# Altium schematic sheet Alim.SchDoc
size A; SheetNumber: 1; SheetTotal: 3
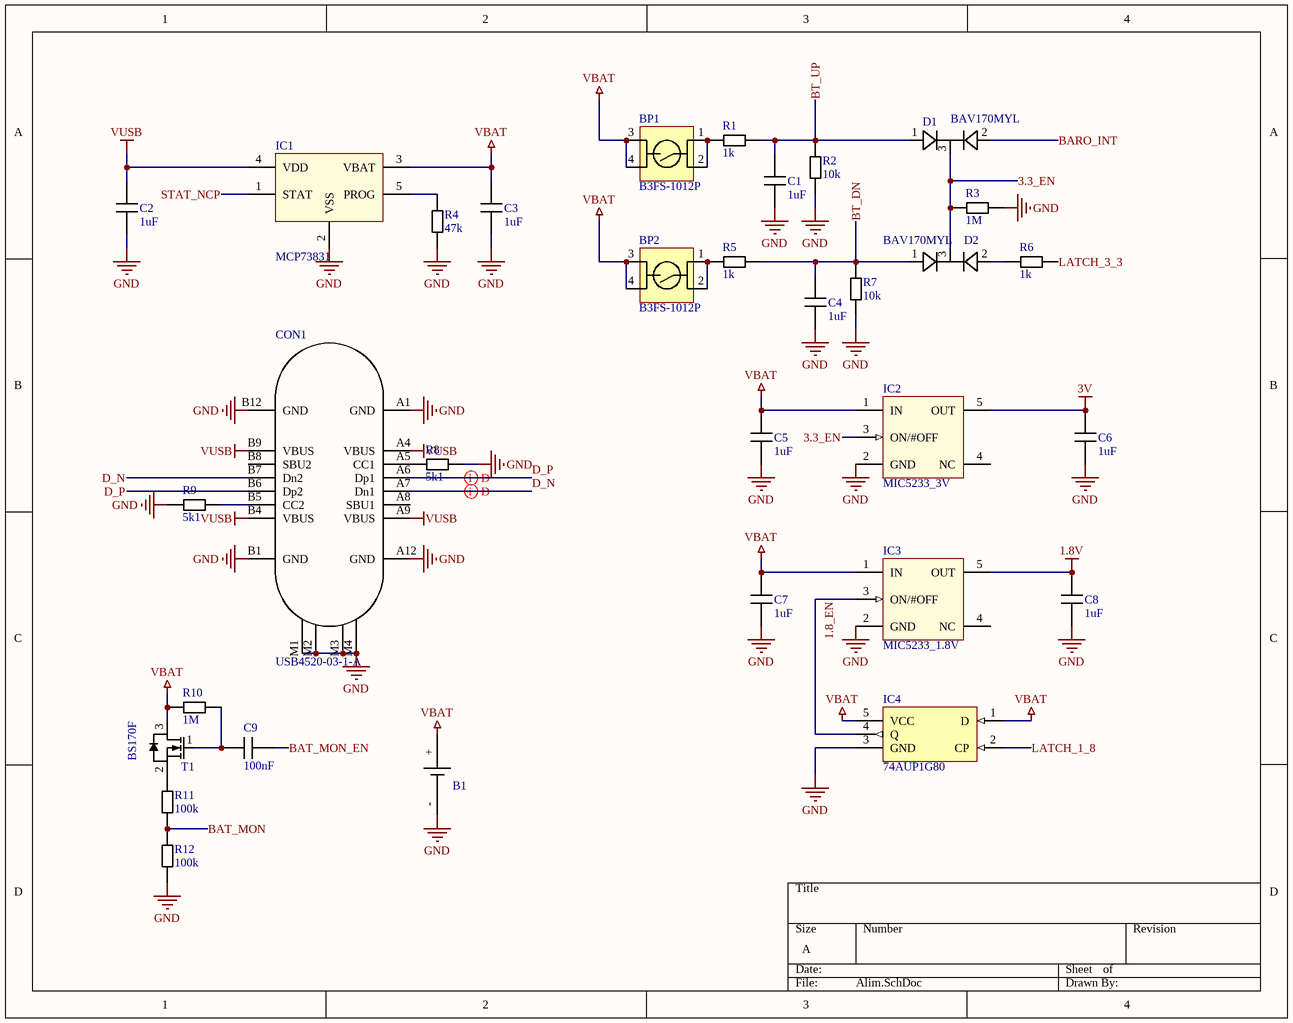
[diagram p0: Alim.SchDoc]

## Parts
B1  EC382704P-T  [EC382704P-T]  (value not drawn)
BP1  B3FS-1012P  [B3FS]
BP2  B3FS-1012P  [B3FS]
C1  value 1uF  [C0402]  (hidden comment: 1uF (0402) AEC-Q200)
C2  value 1uF  [C0402]  (hidden comment: 1uF (0402) AEC-Q200)
C3  value 1uF  [C0402]  (hidden comment: 1uF (0402) AEC-Q200)
C4  value 1uF  [C0402]  (hidden comment: 1uF (0402) AEC-Q200)
C5  value 1uF  [C0402]  (hidden comment: 1uF (0402) AEC-Q200)
C6  value 1uF  [C0402]  (hidden comment: 1uF (0402) AEC-Q200)
C7  value 1uF  [C0402]  (hidden comment: 1uF (0402) AEC-Q200)
C8  value 1uF  [C0402]  (hidden comment: 1uF (0402) AEC-Q200)
C9  value 100nF  [C0402]  (hidden comment: 100nF (0402) AEC-Q200)
CON1  USB4520-03-1-A  [USB4520-03-1-A]
D1  BAV170MYL  [DFN1006-3]
D2  BAV170MYL  [DFN1006-3]
IC1  MCP73831  [SOT23-5]
IC2  MIC5233_3V  [SOT23-5]
IC3  MIC5233_1.8V  [SOT23-5]
IC4  74AUP1G80  [TSSOP5]
R1  value 1k  [R0402]  (hidden comment: 1k (0402))
R2  value 10k  [R0402]  (hidden comment: 10k (0402))
R3  value 1M  [R0402]  (hidden comment: 1M (0402))
R4  value 47k  [R0402]  (hidden comment: 47k (0402))
R5  value 1k  [R0402]  (hidden comment: 1k (0402))
R6  value 1k  [R0402]  (hidden comment: 1k (0402))
R7  value 10k  [R0402]  (hidden comment: 10k (0402))
R8  value 5k1  [R0402]  (hidden comment: 5k1 (0402) AEC-Q200)
R9  value 5k1  [R0402]  (hidden comment: 5k1 (0402) AEC-Q200)
R10  value 1M  [R0402]  (hidden comment: 1M (0402))
R11  value 100k  [R0402]  (hidden comment: 100k (0402))
R12  value 100k  [R0402]  (hidden comment: 100k (0402))
T1  BS170F  [SOT-23-3]

## Nets
1.8V: C8.1 IC3.5(OUT)
3V: C6.1 IC2.5(OUT)
GND: B1.- C1.2 C2.2 C3.2 C4.2 C5.2 C6.2 C7.2 C8.2 CON1.A1(GND) CON1.A12(GND) CON1.B1(GND) CON1.B12(GND) CON1.M1 CON1.M2 CON1.M3 CON1.M4 IC1.2(VSS) IC2.2(GND) IC3.2(GND) IC4.3(GND) R2.1 R3.1 R4.1 R7.1 R8.2 R9.1 R12.1
VBAT: B1.+ BP1.3 BP1.4 BP2.3 BP2.4 C3.1 C5.1 C7.1 IC1.3(VBAT) IC2.1(IN) IC3.1(IN) IC4.1(D) IC4.5(VCC) R10.1 T1.3(D)
VUSB: C2.1 CON1.A4(VBUS) CON1.A9(VBUS) CON1.B4(VBUS) CON1.B9(VBUS) IC1.4(VDD)
3.3_EN: D1.3(K1/A2) D2.3(K1/A2) IC2.3(ON/#OFF) R3.2
BARO_INT: D1.2(K2)
BAT_MON: R11.1 R12.2
BAT_MON_EN: C9.1
BT_DN: C4.1 D2.1(A1) R5.2 R7.2
BT_UP: C1.1 D1.1(A1) R1.2 R2.2
D_N: CON1.A7(Dn1) CON1.B7(Dn2)
D_P: CON1.A6(Dp1) CON1.B6(Dp2)
LATCH_1_8: IC4.2(CP)
LATCH_3_3: R6.2
STAT_NCP: IC1.1(STAT)
NetBP1_1: BP1.1 BP1.2 R1.1
NetBP2_1: BP2.1 BP2.2 R5.1
NetC9_2: C9.2 R10.2 T1.1(G)
NetCON1_A5: CON1.A5(CC1) R8.1
NetCON1_B5: CON1.B5(CC2) R9.2
NetD2_2: D2.2(K2) R6.1
NetIC1_5: IC1.5(PROG) R4.2
NetIC3_3: IC3.3(ON/#OFF) IC4.4(Q)
NetR11_2: R11.2 T1.2(S)

Not connected (* = marked no-connect by the designer): CON1 A8(SBU1) B8(SBU2); IC2 4(NC); IC3 4(NC)

## Layout directives
differential pair: D_N, D_P

## Notes on the sheet
- Labels drawn without touching a wire or pin: 1.8_EN

## Library data of the parts
B1 = EC382704P-T: 2.3V 25mAh Li-ion; Fabricant: NGH; Référence: EC382704P-T; Value: EC382704P-T
BP1 BP2 = B3FS-1012P: Fabricant: Omron; Référence: B3FS-1012P; Value: B3FS-1012P
C1-C8 = 1uF (0402) AEC-Q200: X7S 10% 0402 10V AEC-Q200; Fabricant: Murata; Référence: GCM155C71A105KE38D
C9 = 100nF (0402) AEC-Q200: X7R 0402 10% 50V AEC-Q200; Référence: GCM155R71H104KE02J; Fabricant: MURATA
CON1 = USB4520-03-1-A: Connecteur USB-C Receptacke mid PCB; Fabricant: GCT; Référence: USB4520-03-1-A; Value: USB4520-03-1-A
D1 D2 = BAV170MYL: Diodes - General Purpose, Power, Switching BAV170M/SOT883/XQFN3; Fabricant: Nexperia; Référence: BAV170MYL; Value: BAV170MYL
IC1 = MCP73831: Chargeur Li-Ion/Li-Polymer; Référence: MCP73831T-2ACI/OT; Fabricant: *; Value: MCP73831
IC2 = MIC5233_3V: 3V || SOT23 || 100mA || IN : 2.3V to 36V; Fabricant: Microchip Technology; Référence: MIC5233-3.0YM5-TR; Value: MIC5233_3V
IC3 = MIC5233_1.8V: 1.8V || SOT23 || 100mA || IN : 2.3V to 36V; Fabricant: Microchip Technology; Référence: MIC5233-1.8YM5-TR; Value: MIC5233_1.8V
IC4 = 74AUP1G80: Low-power D-type flip-flop; positive-edge trigger TSSOP5; Fabricant: NEXPERIA; Référence: 74AUP1G80GW; Value: 74AUP1G80
R1 R5 R6 = 1k (0402): 1% 0402 0.063W 100ppm; Fabricant: MULTICOMP; Référence: MCWR04X1001FTL
R2 R7 = 10k (0402): 1% 0402 0.063W 100ppm; Référence: MCWR04X1002FTL; Fabricant: MULTICOMP
R3 R10 = 1M (0402): 1% 0402 0.063W 100ppm; Fabricant: MULTICOMP; Référence: MCWR04X1004FTL
R4 = 47k (0402): 1% 0402 0.063W 100ppm; Fabricant: MULTICOMP; Référence: MCWR04X4702FTL
R8 R9 = 5k1 (0402) AEC-Q200: 1% 0402 0.1W 100ppm AEC-Q200; Référence: ERJ-2RKF5101X; Fabricant: PANASONIC
R11 R12 = 100k (0402): 1% 0402  0.063W 100ppm; Fabricant: MULTICOMP; Référence: MCWR04X1003FTL
T1 = BS170F: N-MOS || SOT23 60V 150mA; Fabricant: Diodes Inc.; Référence: BS170F; Supplier: Farnell; RefSupplier: 9526005; Value: BS170F